# EAGLE design LiFeLight (EAGLE 7.1.0)
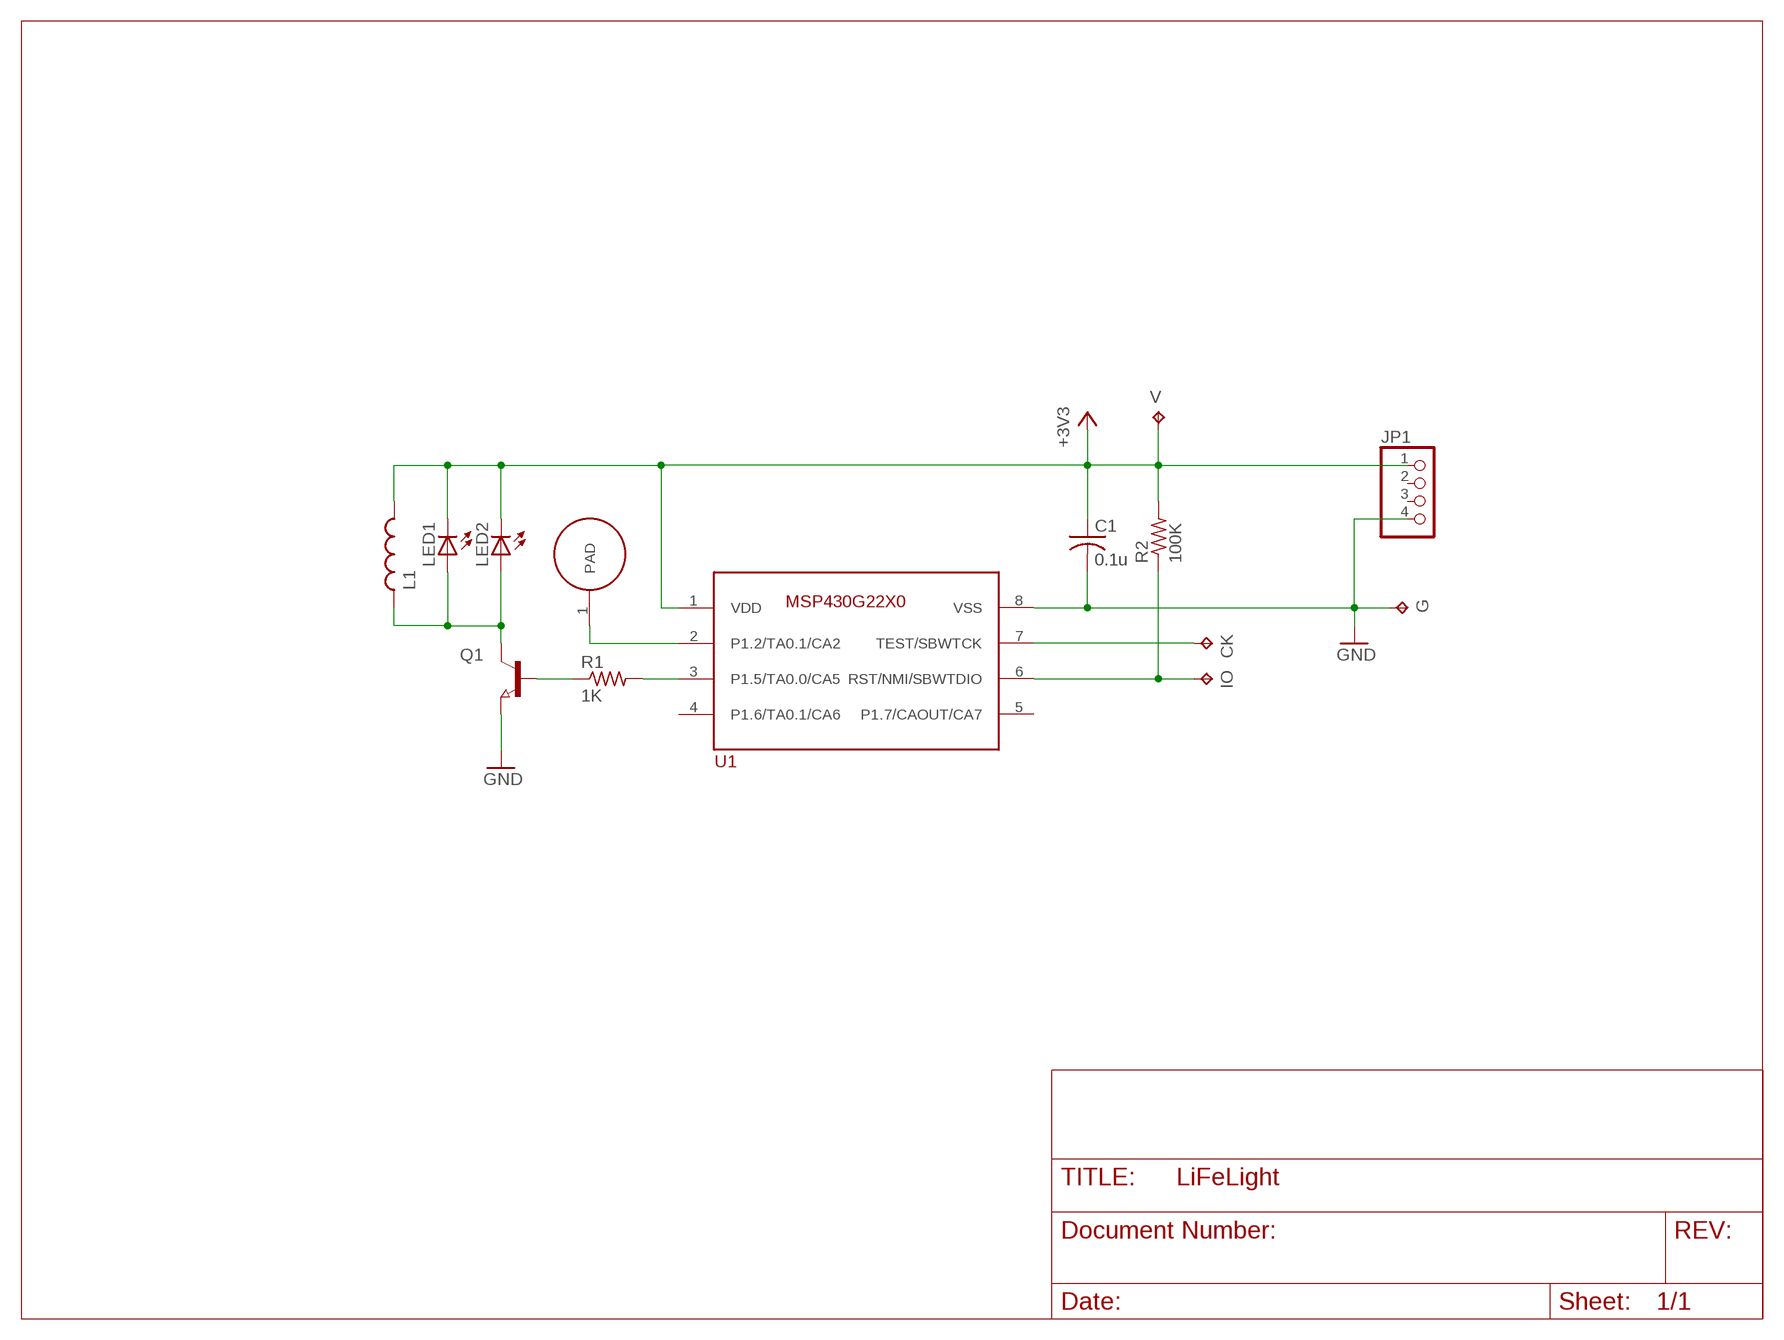
[diagram p0: schematic, sheet 1]

## Parts
C1  0.1u  C-USC0805K  [C0805K]
CK  TPB1,27  [B1,27]
G  TPB1,27  [B1,27]
IO  TPB1,27  [B1,27]
JP1  PINHD-1X4  [1X04]
L1  L-USL2825P  [L2825P]
LED1  LEDSQR2X5  [LED2X5]
LED2  LEDSMT1206  [1206]
Q1  NPN-TRANSISTOR_SOT23  [SOT23]
R1  1K  R-US_R0805  [R0805]
R2  100K  R-US_R0805  [R0805]
TOUCH1  TOUCHPAD8MM  [TOUCHPAD8]
U1  MSP430G22X0  [SO08]
V  TPB1,27  [B1,27]

## Nets
+3V3: C1.1 JP1.1 L1.1 LED1.K(C) LED2.C R2.2 U1.1(VDD) V.TP
GND: C1.2 G.TP JP1.4 Q1.2(E) U1.8(VSS)
N$1: L1.2 LED1.A LED2.A Q1.3(C)
N$2: IO.TP R2.1 U1.6(RST/NMI/SBWTDIO)
N$3: CK.TP U1.7(TEST/SBWTCK)
N$4: Q1.1(B) R1.1
N$5: TOUCH1.1(PAD) U1.2(P1.2/TA0.1/CA2)
N$6: R1.2 U1.3(P1.5/TA0.0/CA5)
Unconnected: JP1.2 JP1.3 U1.4(P1.6/TA0.1/CA6) U1.5(P1.7/CAOUT/CA7)

## Library data of the parts
C1 = rcl:C-US: CAPACITOR, American symbol
CK G IO V = testpad:TP: Test pad
JP1 = pinhead:PINHD-1X4: PIN HEADER
L1 = rcl:L-US: INDUCTOR, American symbol
LED1 LED2 = led:LED: LED OSRAM: - CHIPLED LG R971, LG N971, LY N971, LG Q971, LY Q971, LO R971, LY R971 LH N974, LH R974 LS Q976, LO Q976, LY Q976 LO Q996 - Hyper CHIPLED LW Q18S LB Q993, LB Q99A, LB R99A - SideLED LS A670, LO A670, LY A670, LG A670, LP A670 LB A673, LV A673, LT A673, LW A673 LH A674 LY A675 LS A676, LA A676, LO A676, LY A676, LW A676 LS A679, LY A679, LG A679 - Hyper Micro SIDELED® LS Y876, LA Y876, LO Y876, LY Y876 LT Y87S - SmartLED LW L88C, LW L88S LB L89C, LB L89S, LG L890 LS L89K, LO L89K, LY L89K LS L896, LA L896, LO L896, LY L896 - TOPLED LS T670, LO T670, LY T670, LG T670, LP T670 LSG T670, LSP T670, LSY T670, LOP T670, LYG T670 LG T671, LOG T671, LSG T671 LB T673, LV T673, LT T673, LW T673 LH T674 LS T676, LA T676, LO T676, LY T676, LB T676, LH T676, LSB T676, LW T676 LB T67C, LV T67C, LT T67C, LS T67K, LO T67K, LY T67K, LW E67C LS E67B, LA E67B, LO E67B, LY E67B, LB E67C, LV E67C, LT E67C LW T67C LS T679, LY T679, LG T679 LS T770, LO T770, LY T770, LG T770, LP T770 LB T773, LV T773, LT T773, LW T773 LH T774 LS E675, LA E675, LY E675, LS T675 LS T776, LA T776, LO T776, LY T776, LB T776 LHGB T686 LT T68C, LB T68C - Hyper Mini TOPLED® LB M676 - Mini TOPLED Santana® LG M470 LS M47K, LO M47K, LY M47K Source: http://www.osram.convergy.de LUXEON: - LUMILED® LXK2-PW12-R00, LXK2-PW12-S00, LXK2-PW14-U00, LXK2-PW14-V00 LXK2-PM12-R00, LXK2-PM12-S00, LXK2-PM14-U00 LXK2-PE12-Q00, LXK2-PE12-R00, LXK2-PE12-S00, LXK2-PE14-T00, LXK2-PE14-U00 LXK2-PB12-K00, LXK2-PB12-L00, LXK2-PB12-M00, LXK2-PB14-N00, LXK2-PB14-P00, LXK2-PB14-Q00 LXK2-PR12-L00, LXK2-PR12-M00, LXK2-PR14-Q00, LXK2-PR14-R00 LXK2-PD12-Q00, LXK2-PD12-R00, LXK2-PD12-S00 LXK2-PH12-R00, LXK2-PH12-S00 LXK2-PL12-P00, LXK2-PL12-Q00, LXK2-PL12-R00 Source: www.luxeon.com KINGBRIGHT: KA-3528ASYC Source: www.kingbright.com
Q1 = semicon-smd-ipc:NPN-TRANSISTOR_: NPN TRANSISTOR
R1 R2 = rcl:R-US_: RESISTOR, American symbol
TOUCH1 = LiFeLight:TOUCHPAD: Touch pad
U1 = LiFeLight:MSP430G22X0: MSP430G22X0 http://www.ti.com/lit/ds/symlink/msp430g2210.pdf

## Board
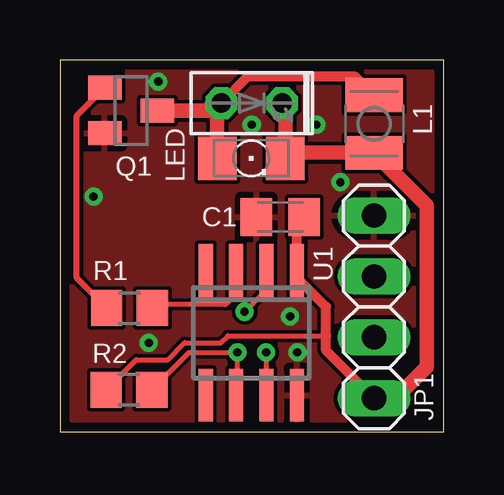
[diagram p1: board, top side]
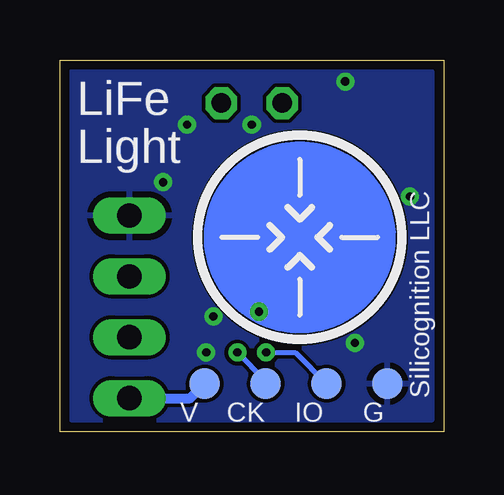
[diagram p2: board, bottom side, seen from below]

Size 16 x 15.5 mm. Coordinates in mm from the lower left corner, seen from the top.
Outline: 0,0 16,0 16,15.5 0,15.5 0,0
Copper layers (1*16): Top 0.035mm / dielectric 1.5mm / Bottom 0.035mm
Design rules "default *": minimum track width 6mil, minimum drill 13mil, track to track 6mil, track to pad 6mil, pad to pad 6mil, via to via 6mil, smd to smd 6mil, copper to edge 15mil, drill to drill 8mil, minimum pad ring 10mil, minimum via ring 8mil, stop-mask expansion 4mil, vias tented up to drill 0mil, thermal gap 10mil

### Footprints (pad centres in the part's own frame; a part is rotated, then mirrored left to right if it is on the bottom)
C0805K = smd 1.3 x 1.6: 1 -1,0; 2 1,0
B1,27 = smd 1.27 x 1.27: TP 0,0
1X04 = drill 1.016 long: 1 -3.81,0; 2 -1.27,0; 3 1.27,0; 4 3.81,0
L2825P = smd 1.4 x 2.4: 1 -1.2,0; 2 1.2,0
LED2X5 = drill 0.813 octagon: A -1.27,0; K 1.27,0
1206 = smd 1.6 x 1.803: A -1.422,0; C 1.422,0
SOT23 = smd 1 x 1.4: 1 -0.95,-1.1; 2 0.95,-1.1; 3 0,1.1
R0805 = smd 1.3 x 1.5: 1 -0.95,0; 2 0.95,0
TOUCHPAD8 = smd 0 x 0: 1 0,0
SO08 = smd 0.6 x 2.2: 1 -1.905,-2.6; 2 -0.635,-2.6; 3 0.635,-2.6; 4 1.905,-2.6; 5 1.905,2.6; 6 0.635,2.6; 7 -0.635,2.6; 8 -1.905,2.6

### Placement (x,y rotation side)
C1  9.19,8.95 180 top
CK  7.42,2 0 bottom
G  2.34,2 0 bottom
IO  4.88,2 0 bottom
JP1  13.1,5.2 90 top
L1  13.1,12.83 90 top
LED1  8,13.7 0 top
LED2  7.98,11.4 0 top
Q1  2.97,13.39 270 top
R1  2.9,5.15 0 top
R2  2.88,1.75 180 top
TOUCH1  6,8.1 0 bottom
U1  7.98,4.12 180 top
V  9.96,2 0 bottom

### Tracks (layer width: path | path; a pad name or v marks a point on that pad's centre or on a via)
+3V3
  Top 0.2: R2.2 3.18,3 4.5,3 5.2,3.7 6.7,3.7 7,4 11.1,4
  Top 0.406: C1.1 9.88,8.74 U1.1 9.88,6.42 11.1,5.2 11.1,4 11.1,3.39 JP1.1
  Top 0.61: JP1.1 13.99,1.39 15.3,2.7 15.3,9.43 L1.1 9.73,11.63 LED2.C 9.4,13.57 LED1.K
  Bottom 0.406: JP1.1 10.57,1.39 V.TP
GND  (via drill 0.35)
  other vias: 9.9,3.3 9.6,4.8 3.7,3.7 4.1,14.6 1.4,9.8 8,12.8 10.7,12.8 11.7,10.4
  pour Bottom: 0.5,15 15.5,15 15.5,0.5 0.5,0.5
  pour Top: 0.5,15 15.5,15 15.5,0.5 0.5,0.5
N$1
  Top 0.406: L1.2 12.33,14.8 7.83,14.8 LED1.A
  Top 0.61: LED1.A 6.56,13.53 LED2.A | 6.52,13.49 LED1.A | Q1.3 6.42,13.39 LED1.A
N$2  (via drill 0.35)
  Top 0.2: U1.6 7.4,1.57 v7.4,3.3 5.38,3.3 R2.1
  Bottom 0.2: v7.4,3.3 6.18,3.3 IO.TP
N$3  (via drill 0.35)
  Top 0.2: U1.7 8.62,3.29 v8.6,3.3
  Bottom 0.2: CK.TP 7.42,2.12 v8.6,3.3
N$4
  Top 0.254: R1.1 0.7,6.4 0.7,13.17 Q1.1
N$5  (via drill 0.35)
  Top 0.2: U1.2 8.62,5.71 8.41,5.71 v7.7,5
  Bottom 0.2: v7.7,5 7.7,6.4 TOUCH1.1
N$6
  Top 0.2: U1.3 7.34,5.75 6.9,5.3 4,5.3 R1.2

### Text on the board
bPlace: LiFe | Light | Silicognition LLC
tNames: LED